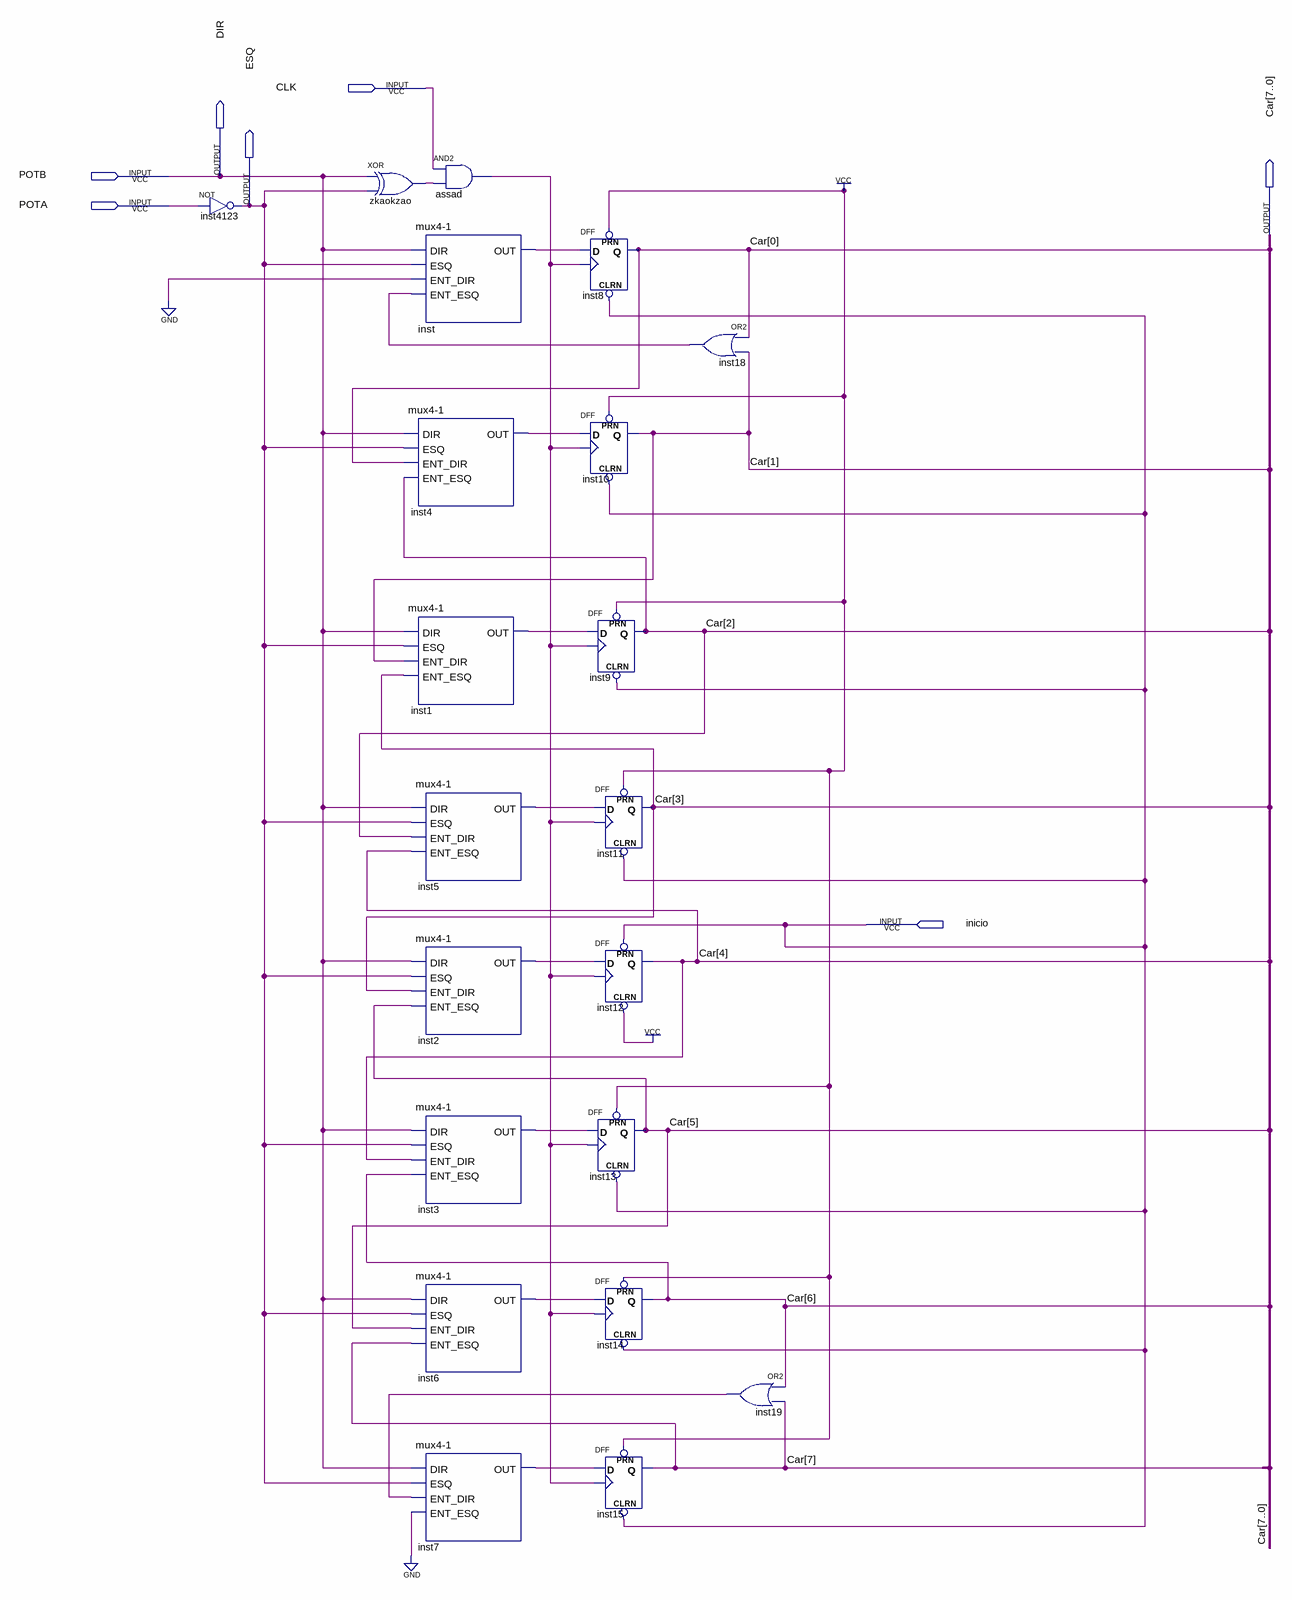
[diagram p0: schematic sheet]
// Quartus schematic mov_carrinho.bdf as structural Verilog: 21 symbols, 7 pins
module mov_carrinho (
  input  CLK,
  input  POTB,
  input  POTA,
  input  inicio,
  output DIR,
  output ESQ,
  output [7:0] Car
);

  wire assad_out, inst1_out, inst2_out, inst3_out, inst4_out, inst5_out, inst6_out, inst7_out, inst18_out,
       inst19_out, inst_out, zkaokzao_out;

  not inst4123 (ESQ, POTA);
  xor zkaokzao (zkaokzao_out, POTB, ESQ);
  and assad (assad_out, CLK, zkaokzao_out);
  \mux4-1  inst (.DIR(POTB), .ESQ(ESQ), .ENT_DIR(1'b0), .ENT_ESQ(inst18_out), .OUT(inst_out));
  \mux4-1  inst4 (.DIR(POTB), .ESQ(ESQ), .ENT_DIR(Car[0]), .ENT_ESQ(Car[2]), .OUT(inst4_out));
  \mux4-1  inst1 (.DIR(POTB), .ESQ(ESQ), .ENT_DIR(Car[1]), .ENT_ESQ(Car[3]), .OUT(inst1_out));
  \mux4-1  inst5 (.DIR(POTB), .ESQ(ESQ), .ENT_DIR(Car[2]), .ENT_ESQ(Car[4]), .OUT(inst5_out));
  \mux4-1  inst2 (.DIR(POTB), .ESQ(ESQ), .ENT_DIR(Car[3]), .ENT_ESQ(Car[5]), .OUT(inst2_out));
  \mux4-1  inst3 (.DIR(POTB), .ESQ(ESQ), .ENT_DIR(Car[4]), .ENT_ESQ(Car[6]), .OUT(inst3_out));
  \mux4-1  inst6 (.DIR(POTB), .ESQ(ESQ), .ENT_DIR(Car[5]), .ENT_ESQ(Car[7]), .OUT(inst6_out));
  \mux4-1  inst7 (.DIR(POTB), .ESQ(ESQ), .ENT_DIR(inst19_out), .ENT_ESQ(1'b0), .OUT(inst7_out));
  DFF inst8 (.CLRN(inicio), .CLK(assad_out), .D(inst_out), .PRN(1'b1), .Q(Car[0]));
  DFF inst10 (.CLRN(inicio), .CLK(assad_out), .D(inst4_out), .PRN(1'b1), .Q(Car[1]));
  DFF inst9 (.CLRN(inicio), .CLK(assad_out), .D(inst1_out), .PRN(1'b1), .Q(Car[2]));
  DFF inst11 (.CLRN(inicio), .CLK(assad_out), .D(inst5_out), .PRN(1'b1), .Q(Car[3]));
  DFF inst12 (.CLRN(1'b1), .CLK(assad_out), .D(inst2_out), .PRN(inicio), .Q(Car[4]));
  DFF inst13 (.CLRN(inicio), .CLK(assad_out), .D(inst3_out), .PRN(1'b1), .Q(Car[5]));
  DFF inst14 (.CLRN(inicio), .CLK(assad_out), .D(inst6_out), .PRN(1'b1), .Q(Car[6]));
  DFF inst15 (.CLRN(inicio), .CLK(assad_out), .D(inst7_out), .PRN(1'b1), .Q(Car[7]));
  or inst18 (inst18_out, Car[0], Car[1]);
  or inst19 (inst19_out, Car[6], Car[7]);

  assign DIR = POTB;
endmodule
